# Altium schematic sheet Battery_Management.SchDoc: Battery Management Circuit
size A4; Address3: Self Checkout Shopping Cart; DocumentNumber: 1; Revision: 1.0; SheetNumber: 1; SheetTotal: 7
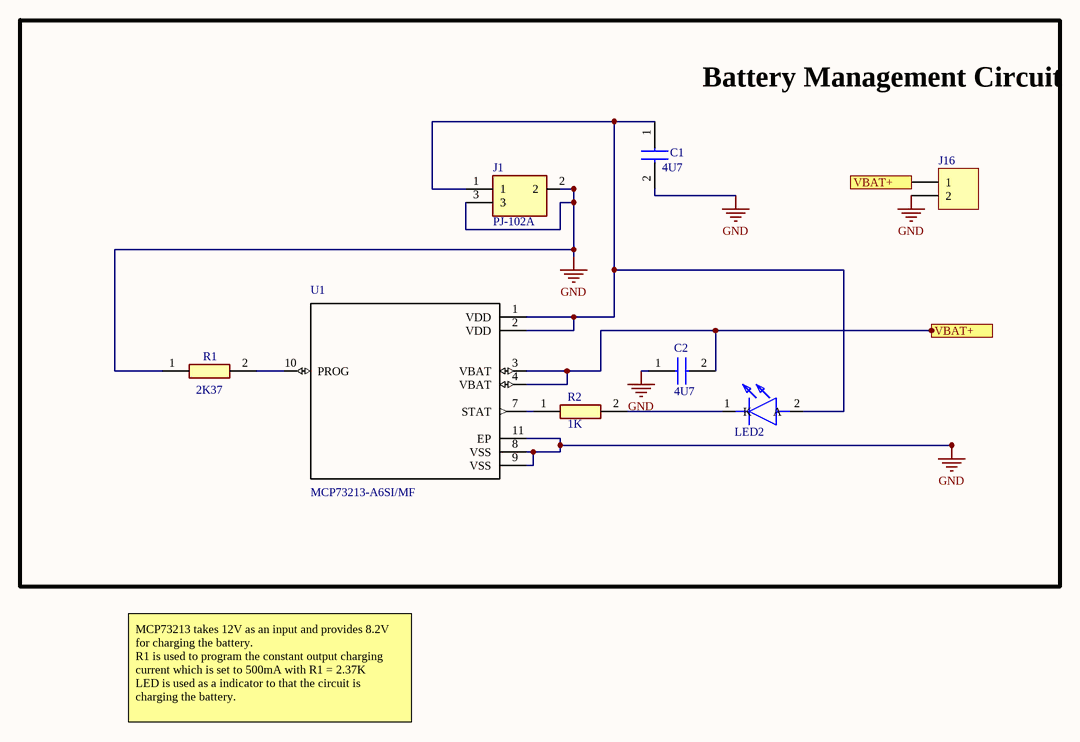
[diagram p0: Battery_Management.SchDoc]

## Parts
C1  value 4U7  [CAPC1608X90N]  (hidden comment: GRM188R61E475KE11D)
C2  value 4U7  [CAPC1608X90N]  (hidden comment: GRM188R61E475KE11D)
J1  PJ-102A  [PJ-102AH]
J16  Header 2  [HDR1X2]  (value not drawn)
LED2  SML-D12U1WT86  [LEDC1608X65N]  (value not drawn)
R1  value 2K37  [RESC1608X55N]  (hidden comment: ERJ-3EKF2371V)
R2  value 1K  [RESC1608X55N]  (hidden comment: RC0603FR-071KL)
U1  MCP73213-A6SI/MF  [*SON50P300X300X100-11N]

## Blocks framed on the sheet
Battery Management Circuit: C1 C2 J1 J16 LED2 R1 R2 U1

## Ports
VBAT+

## Nets
GND: C1.2 C2.1 J1.2 J1.3 J16.2 R1.1 U1.8(VSS) U1.9(VSS) U1.11(EP)
VBAT+: C2.2 J16.1 U1.3(VBAT) U1.4(VBAT) ; port VBAT+
NetC1_1: C1.1 J1.1 LED2.2(A) U1.1(VDD) U1.2(VDD)
NetLED2_1: LED2.1(K) R2.2
NetR1_2: R1.2 U1.10(PROG)
NetR2_1: R2.1 U1.7(STAT)

## Notes on the sheet
- MCP73213 takes 12V as an input and provides 8.2V for charging the battery.
  R1 is used to program the constant output charging current which is set to 500mA with R1 = 2.37K
  LED is used as a indicator to that the circuit is charging the battery.
- Title
- Size:
- Date:
- A4
- Number:
- Time:
- Revision:
- Sheet
- of
- File:

## Library data of the parts
C1 C2 = GRM188R61E475KE11D: Capacitor; Manufacturer_Name: Murata Electronics; Datasheet Link: https://psearch.en.murata.com/capacitor/product/GRM188R61E475KE11%23.html; Height: 0.9mm; Manufacturer_Part_Number: GRM188R61E475KE11D; Mouser Part Number: 81-GRM188R61E475KE1D; Mouser Price/Stock: https://www.mouser.com/Search/Refine.aspx?Keyword=81-GRM188R61E475KE1D; RS Part Number: 8151386P; RS Price/Stock: http://uk.rs-online.com/web/p/products/8151386P
J1 = PJ-102A: Connector; Manufacturer_Name: CUI; Datasheet Link: https://www.cui.com/product/resource/pj-102a.pdf; Manufacturer_Part_Number: PJ-102A; Mouser Part Number: 490-PJ-102A; Mouser Price/Stock: https://www.mouser.com/Search/Refine.aspx?Keyword=490-PJ-102A
J16 = Header 2: Header, 2-Pin; Manufacturer_Part_Number: BG301-04-A-0540-L-B; Manufacturer_Name: Global Connector Technology; Digi-Key Part Number: 2073-BG301-02-A-0540-L-BCT-ND; Value: *; Digikey Price/Stock: https://www.digikey.com/product-detail/en/gct/BG301-04-A-0540-L-B/2073-BG301-04-A-0540-L-BCT-ND/9859670?utm_source=snapeda&utm_medium=aggregator&utm_campaign=symbol
LED2 = SML-D12U1WT86: LED; Manufacturer_Name: ROHM Semiconductor; Datasheet Link: https://componentsearchengine.com/Datasheets/1/SML-D12U1WT86.pdf; Height: 0.65mm; Manufacturer_Part_Number: SML-D12U1WT86; Mouser Part Number: 755-SML-D12U1WT86; Mouser Price/Stock: https://www.mouser.com/Search/Refine.aspx?Keyword=755-SML-D12U1WT86; RS Part Number: 1332870P; RS Price/Stock: http://uk.rs-online.com/web/p/products/1332870P
R1 = ERJ-3EKF2371V: Resistor; Manufacturer_Name: Panasonic; Allied_Number: 70265728; Datasheet Link: http://industrial.panasonic.com/cdbs/www-data/pdf/RDA0000/AOA0000C86.pdf; Height: 0.55mm; Manufacturer_Part_Number: ERJ-3EKF2371V; Mouser Part Number: 667-ERJ-3EKF2371V; Mouser Price/Stock: https://www.mouser.com/ProductDetail/Panasonic/ERJ-3EKF2371V?qs=%2Fha2pyFadujWqMGonbcVXZxICkDa1SB1kWGUcP49AU%2F%252BFmOkSQluLg%3D%3D; Allied Price/Stock: https://www.alliedelec.com/panasonic-erj-3ekf2371v/70265728/
R2 = RC0603FR-071KL: Resistor; Manufacturer_Name: YAGEO (PHYCOMP); Datasheet Link: http://www.yageo.com/documents/recent/PYu-RC0603_51_RoHS_L_v5.pdf; Height: 0.55mm; Manufacturer_Part_Number: RC0603FR-071KL; Mouser Part Number: 603-RC0603FR-071KL; Mouser Price/Stock: https://www.mouser.com/Search/Refine.aspx?Keyword=603-RC0603FR-071KL; RS Part Number: 5048928
U1 = MCP73213-A6SI/MF: MCP Series 16V Dual-Cell Li-Ion/Li-Polymer Battery Charge Management Controller; Manufacturer_Name: Microchip; Package: DFN-10 Microchip; Price: None; Value: *; Manufacturer_Part_Number: MCP73213-A6SI/MF; Digikey Price/Stock: https://www.digikey.com/product-detail/en/microchip-technology/MCP73213T-A6SI-MF/MCP73213T-A6SI-MFCT-ND/8628856?utm_adgroup=Integrated%20Circuits&slid=&gclid=EAIaIQobChMI7N75w5-p5QIVkMJkCh3tQQYeEAAYASAAEgJH9PD_BwE; Digi-Key Part Number: MCP73213T-A6SI/MF; Datasheet Link: http://ww1.microchip.com/downloads/en/DeviceDoc/20002190D.pdf